# Altium schematic sheet 9_rs485.SchDoc: RS485 Bus
size A4; DocumentNumber: 10; SheetNumber: 10; SheetTotal: 11
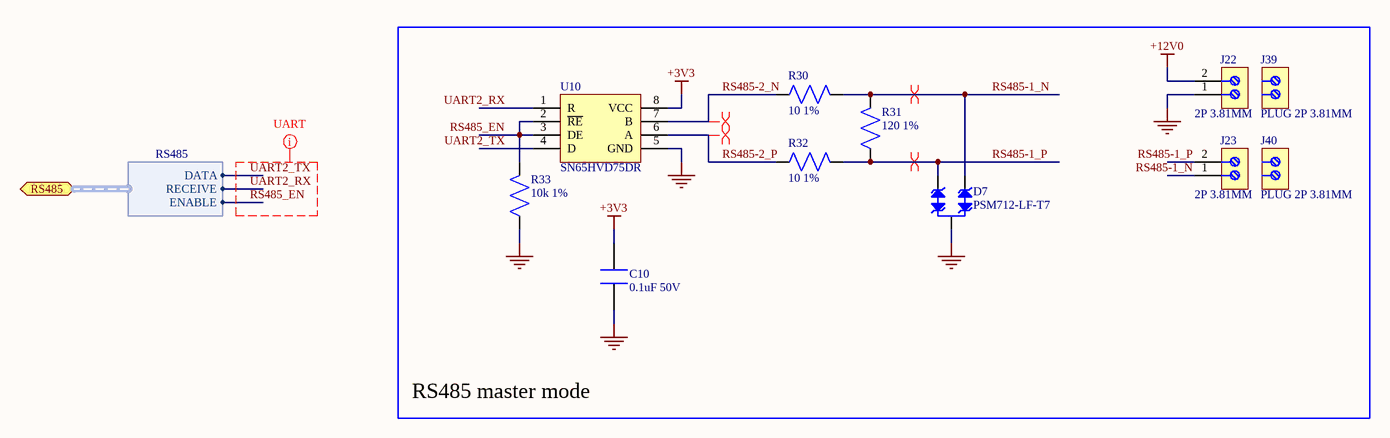
[diagram p0: 9_rs485.SchDoc]

## Parts
C10  0.1uF 50V  [C0603]
D7  PSM712-LF-T7  [SOT-23-3]
J22  2P 3.81MM  [TB-2P-3.81MM]  (no BOM)
J23  2P 3.81MM  [TB-2P-3.81MM]  (no BOM)
J39  PLUG 2P 3.81MM  [TB-PLUG-2P-3.81MM]  (no BOM)
J40  PLUG 2P 3.81MM  [TB-PLUG-2P-3.81MM]  (no BOM)
R30  10 1%  [R0603]
R31  120 1%  [R0603]
R32  10 1%  [R0603]
R33  10k 1%  [R0603]
U10  SN65HVD75DR  [SOIC-8]

## Blocks framed on the sheet
RS485 master mode: C10 D7 J22 J23 J39 J40 R30-R33 U10

## Ports
RS485 (bidir, harness RS485)

## Harnesses
RS485: DATA, RECEIVE, ENABLE

## Nets
+3V3: C10.1 U10.8(VCC)
+12V0: J22.2
GND: C10.2 D7.3 J22.1 R33.1 U10.5(GND)
RS485-1_N: D7.2 J23.1 R30.2 R31.2
RS485-1_P: D7.1 J23.2 R31.1 R32.2
RS485-2_N: R30.1 U10.7(B)
RS485-2_P: R32.1 U10.6(A)
RS485_EN: R33.2 U10.2(~{RE}) U10.3(DE) ; port RS485.ENABLE
UART2_RX: U10.1(R) ; port RS485.RECEIVE
UART2_TX: U10.4(D) ; port RS485.DATA

## Layout directives
differential pair: RS485-1_N, RS485-1_P, RS485-2_N, RS485-2_P
net class UART: RS485_EN, UART2_RX, UART2_TX

## Notes on the sheet
- Title
- Size:
- Date:
- A4
- Number:
- Time:
- Revision:
- Sheet
- of
- SmartyBoy
- alkonosst
- github.com/alkonosst <http://github.com/alkonosst>
- Designer:

## Library data of the parts
C10 = CC0603KRX7R9BB104: X7R 100nF ±10% 50V 0603 Multilayer Ceramic Capacitors MLCC - SMD/SMT; LCSC part: C14663; Category: Capacitors: Multilayer Ceramic Capacitors MLCC - SMD/SMT
D7 = PSM712-LF-T7: Bidirectional - 19V 13.3V 12V SOT-23(SOT-23-3) TVS; Category: Diodes: TVS; LCSC part: C32677
J22 J23 = TBLOCK-2P-3.81MM: Terminal Block 2 Positions 3.81MM; Category: Connectors: Pluggable System Terminal Block
J39 J40 = PLUG-2P-3.81MM: Terminal block plug 2positions 3.81mm; Category: Connectors: Pluggable System Terminal Block
R30 R32 = 0603WAF100JT5E: ±1% ±400ppm/℃ 10Ω 0.1W 0603 Chip Resistor - Surface Mount; LCSC part: C22859; Category: Resistors: Chip Resistor - Surface Mount
R31 = 0603WAF1200T5E: ±1% ±100ppm/℃ 120Ω 0.1W 0603 Chip Resistor - Surface Mount; LCSC part: C22787; Category: Resistors: Chip Resistor - Surface Mount
R33 = 0603WAF1002T5E: ±1% ±100ppm/℃ 10kΩ 0.1W 0603 Chip Resistor - Surface Mount; LCSC part: C25804; Category: Resistors: Chip Resistor - Surface Mount
U10 = SN65HVD75DR: Transceiver 1/1 RS422, RS485 20Mbps SOIC-8_150mil RS-485/RS-422 ICs; LCSC part: C57928; Category: Interface ICs: RS-485/RS-422 ICs